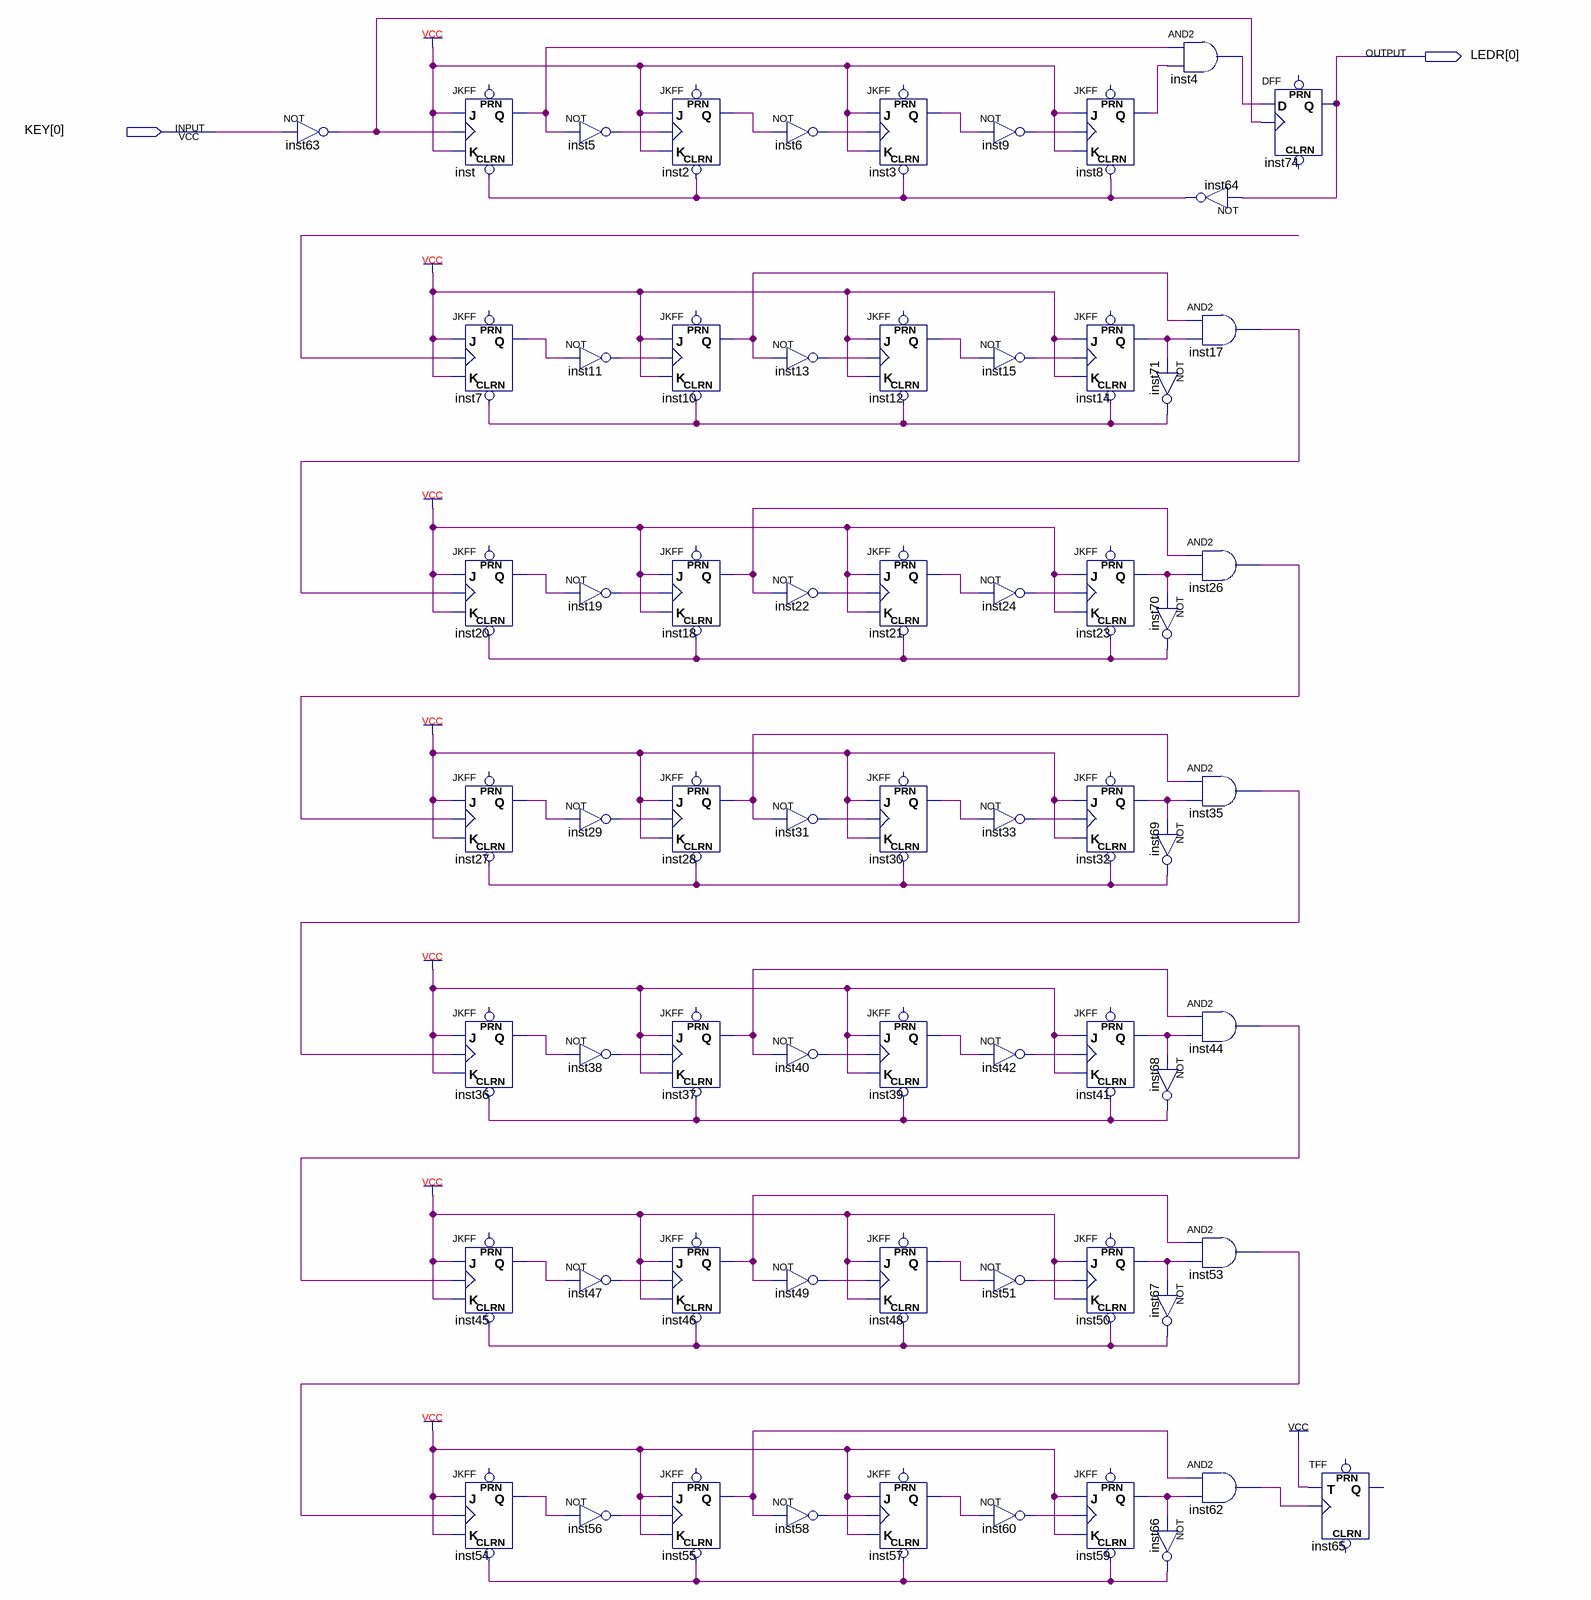
[diagram p0: schematic sheet]
// Quartus schematic delic_casu.bdf as structural Verilog: 66 symbols, 2 pins
module delic_casu (
  input  [0:0] KEY,
  output [0:0] LEDR
);

  wire inst2_q, inst3_q, inst4_out, inst5_out, inst6_out, inst7_q, inst8_q, inst9_out, inst10_q, inst11_out,
       inst12_q, inst13_out, inst14_q, inst15_out, inst17_out, inst18_q, inst19_out, inst20_q, inst21_q,
       inst22_out, inst23_q, inst24_out, inst26_out, inst27_q, inst28_q, inst29_out, inst30_q, inst31_out,
       inst32_q, inst33_out, inst35_out, inst36_q, inst37_q, inst38_out, inst39_q, inst40_out, inst41_q,
       inst42_out, inst44_out, inst45_q, inst46_q, inst47_out, inst48_q, inst49_out, inst50_q, inst51_out,
       inst53_out, inst54_q, inst55_q, inst56_out, inst57_q, inst58_out, inst59_q, inst60_out, inst62_out,
       inst63_out, inst64_out, inst66_out, inst67_out, inst68_out, inst69_out, inst70_out, inst71_out,
       inst_q, undriven;

  not inst63 (inst63_out, KEY[0]);
  JKFF inst (.CLRN(inst64_out), .K(1'b1), .J(1'b1), .CLK(inst63_out), .Q(inst_q));  // open: PRN
  JKFF inst7 (.CLRN(inst71_out), .K(1'b1), .J(1'b1), .CLK(undriven), .Q(inst7_q));  // open: PRN
  JKFF inst20 (.CLRN(inst70_out), .K(1'b1), .J(1'b1), .CLK(inst17_out), .Q(inst20_q));  // open: PRN
  JKFF inst27 (.CLRN(inst69_out), .K(1'b1), .J(1'b1), .CLK(inst26_out), .Q(inst27_q));  // open: PRN
  JKFF inst36 (.CLRN(inst68_out), .K(1'b1), .J(1'b1), .CLK(inst35_out), .Q(inst36_q));  // open: PRN
  JKFF inst45 (.CLRN(inst67_out), .K(1'b1), .J(1'b1), .CLK(inst44_out), .Q(inst45_q));  // open: PRN
  JKFF inst54 (.CLRN(inst66_out), .K(1'b1), .J(1'b1), .CLK(inst53_out), .Q(inst54_q));  // open: PRN
  not inst5 (inst5_out, inst_q);
  not inst11 (inst11_out, inst7_q);
  not inst19 (inst19_out, inst20_q);
  not inst29 (inst29_out, inst27_q);
  not inst38 (inst38_out, inst36_q);
  not inst47 (inst47_out, inst45_q);
  not inst56 (inst56_out, inst54_q);
  JKFF inst2 (.CLRN(inst64_out), .K(1'b1), .J(1'b1), .CLK(inst5_out), .Q(inst2_q));  // open: PRN
  JKFF inst10 (.CLRN(inst71_out), .K(1'b1), .J(1'b1), .CLK(inst11_out), .Q(inst10_q));  // open: PRN
  JKFF inst18 (.CLRN(inst70_out), .K(1'b1), .J(1'b1), .CLK(inst19_out), .Q(inst18_q));  // open: PRN
  JKFF inst28 (.CLRN(inst69_out), .K(1'b1), .J(1'b1), .CLK(inst29_out), .Q(inst28_q));  // open: PRN
  JKFF inst37 (.CLRN(inst68_out), .K(1'b1), .J(1'b1), .CLK(inst38_out), .Q(inst37_q));  // open: PRN
  JKFF inst46 (.CLRN(inst67_out), .K(1'b1), .J(1'b1), .CLK(inst47_out), .Q(inst46_q));  // open: PRN
  JKFF inst55 (.CLRN(inst66_out), .K(1'b1), .J(1'b1), .CLK(inst56_out), .Q(inst55_q));  // open: PRN
  not inst6 (inst6_out, inst2_q);
  not inst13 (inst13_out, inst10_q);
  not inst22 (inst22_out, inst18_q);
  not inst31 (inst31_out, inst28_q);
  not inst40 (inst40_out, inst37_q);
  not inst49 (inst49_out, inst46_q);
  not inst58 (inst58_out, inst55_q);
  JKFF inst3 (.CLRN(inst64_out), .K(1'b1), .J(1'b1), .CLK(inst6_out), .Q(inst3_q));  // open: PRN
  JKFF inst12 (.CLRN(inst71_out), .K(1'b1), .J(1'b1), .CLK(inst13_out), .Q(inst12_q));  // open: PRN
  JKFF inst21 (.CLRN(inst70_out), .K(1'b1), .J(1'b1), .CLK(inst22_out), .Q(inst21_q));  // open: PRN
  JKFF inst30 (.CLRN(inst69_out), .K(1'b1), .J(1'b1), .CLK(inst31_out), .Q(inst30_q));  // open: PRN
  JKFF inst39 (.CLRN(inst68_out), .K(1'b1), .J(1'b1), .CLK(inst40_out), .Q(inst39_q));  // open: PRN
  JKFF inst48 (.CLRN(inst67_out), .K(1'b1), .J(1'b1), .CLK(inst49_out), .Q(inst48_q));  // open: PRN
  JKFF inst57 (.CLRN(inst66_out), .K(1'b1), .J(1'b1), .CLK(inst58_out), .Q(inst57_q));  // open: PRN
  not inst9 (inst9_out, inst3_q);
  not inst15 (inst15_out, inst12_q);
  not inst24 (inst24_out, inst21_q);
  not inst33 (inst33_out, inst30_q);
  not inst42 (inst42_out, inst39_q);
  not inst51 (inst51_out, inst48_q);
  not inst60 (inst60_out, inst57_q);
  JKFF inst8 (.CLRN(inst64_out), .K(1'b1), .J(1'b1), .CLK(inst9_out), .Q(inst8_q));  // open: PRN
  JKFF inst14 (.CLRN(inst71_out), .K(1'b1), .J(1'b1), .CLK(inst15_out), .Q(inst14_q));  // open: PRN
  JKFF inst23 (.CLRN(inst70_out), .K(1'b1), .J(1'b1), .CLK(inst24_out), .Q(inst23_q));  // open: PRN
  JKFF inst32 (.CLRN(inst69_out), .K(1'b1), .J(1'b1), .CLK(inst33_out), .Q(inst32_q));  // open: PRN
  JKFF inst41 (.CLRN(inst68_out), .K(1'b1), .J(1'b1), .CLK(inst42_out), .Q(inst41_q));  // open: PRN
  JKFF inst50 (.CLRN(inst67_out), .K(1'b1), .J(1'b1), .CLK(inst51_out), .Q(inst50_q));  // open: PRN
  JKFF inst59 (.CLRN(inst66_out), .K(1'b1), .J(1'b1), .CLK(inst60_out), .Q(inst59_q));  // open: PRN
  not inst71 (inst71_out, inst14_q);
  not inst70 (inst70_out, inst23_q);
  not inst69 (inst69_out, inst32_q);
  not inst68 (inst68_out, inst41_q);
  not inst67 (inst67_out, inst50_q);
  not inst66 (inst66_out, inst59_q);
  and inst4 (inst4_out, inst_q, inst8_q);
  not inst64 (inst64_out, LEDR[0]);
  and inst17 (inst17_out, inst10_q, inst14_q);
  and inst26 (inst26_out, inst18_q, inst23_q);
  and inst35 (inst35_out, inst28_q, inst32_q);
  and inst44 (inst44_out, inst37_q, inst41_q);
  and inst53 (inst53_out, inst46_q, inst50_q);
  and inst62 (inst62_out, inst55_q, inst59_q);
  DFF inst74 (.CLK(inst63_out), .D(inst4_out), .Q(LEDR[0]));  // open: CLRN, PRN
  TFF inst65 (.T(1'b1), .CLK(inst62_out));  // open: PRN, CLRN, Q
endmodule
